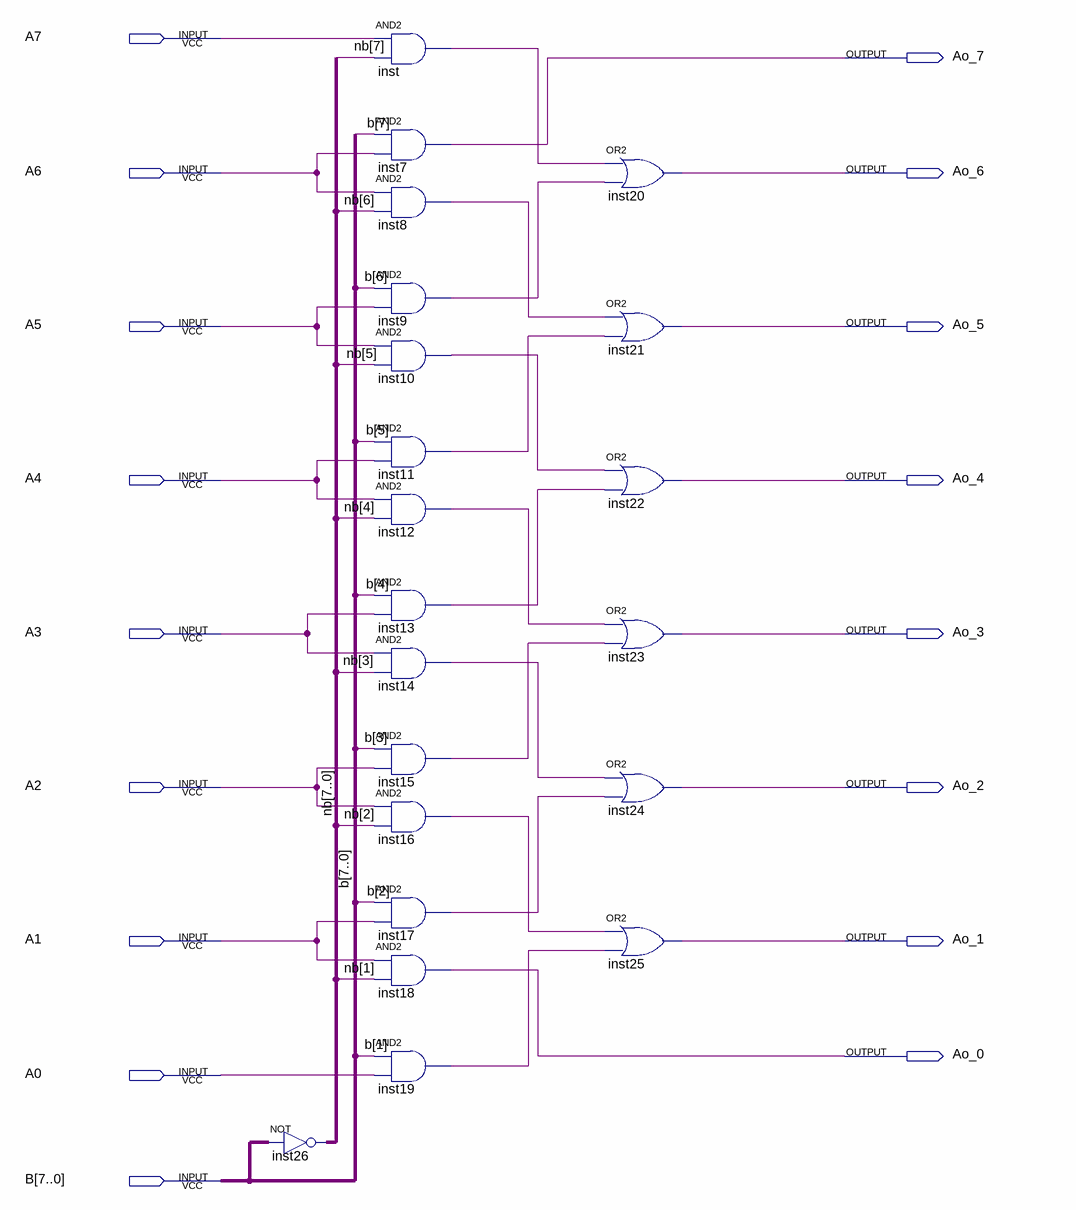
[diagram p0: schematic sheet]
// Quartus schematic SRL_ALU.bdf as structural Verilog: 21 symbols, 17 pins
module SRL_ALU (
  input  A7,
  input  A6,
  input  A5,
  input  A4,
  input  A3,
  input  A2,
  input  A1,
  input  A0,
  input  [7:0] B,
  output Ao_7,
  output Ao_6,
  output Ao_5,
  output Ao_4,
  output Ao_3,
  output Ao_2,
  output Ao_1,
  output Ao_0
);

  wire inst8_out, inst9_out, inst10_out, inst11_out, inst12_out, inst13_out, inst14_out, inst15_out,
       inst16_out, inst17_out, inst19_out, inst_out;
  wire [7:0] nb;

  assign nb = ~B;  // NOT inst26, 8 bits wide
  and inst (inst_out, A7, nb[7]);
  and inst7 (Ao_7, B[7], A6);
  and inst8 (inst8_out, A6, nb[6]);
  and inst9 (inst9_out, B[6], A5);
  and inst10 (inst10_out, A5, nb[5]);
  and inst11 (inst11_out, B[5], A4);
  and inst12 (inst12_out, A4, nb[4]);
  and inst13 (inst13_out, B[4], A3);
  and inst14 (inst14_out, A3, nb[3]);
  and inst15 (inst15_out, B[3], A2);
  and inst16 (inst16_out, A2, nb[2]);
  and inst17 (inst17_out, B[2], A1);
  and inst18 (Ao_0, A1, nb[1]);
  and inst19 (inst19_out, B[1], A0);
  or inst20 (Ao_6, inst_out, inst9_out);
  or inst21 (Ao_5, inst8_out, inst11_out);
  or inst22 (Ao_4, inst10_out, inst13_out);
  or inst23 (Ao_3, inst12_out, inst15_out);
  or inst24 (Ao_2, inst14_out, inst17_out);
  or inst25 (Ao_1, inst16_out, inst19_out);
endmodule
